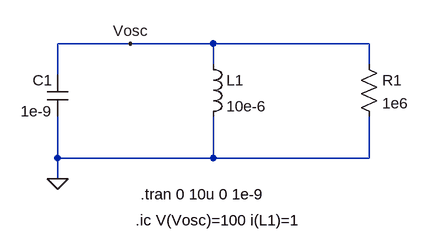
[diagram p0: schematic LCOscill.asc]
LCOscill.asc, the LTspice schematic file:
Version 4
SHEET 1 880 680
WIRE 336 96 224 96
WIRE 464 96 336 96
WIRE 704 96 464 96
WIRE 464 128 464 96
WIRE 704 128 704 96
WIRE 224 144 224 96
WIRE 224 272 224 208
WIRE 464 272 464 208
WIRE 464 272 224 272
WIRE 704 272 704 208
WIRE 704 272 464 272
WIRE 224 304 224 272
FLAG 224 304 0
FLAG 336 96 Vosc
SYMBOL cap 240 208 R180
WINDOW 0 24 56 Left 2
WINDOW 3 24 8 Left 2
SYMATTR InstName C1
SYMATTR Value 1e-9
SYMBOL ind 448 112 R0
SYMATTR InstName L1
SYMATTR Value 10e-6
SYMBOL res 688 112 R0
SYMATTR InstName R1
SYMATTR Value 1e6
TEXT 352 328 Left 2 !.tran 0 10u 0 1e-9
TEXT 344 368 Left 2 !.ic V(Vosc)=100 i(L1)=1

The netlist it stands for:
* LCOscill.asc
C1 0 Vosc 1e-9
L1 Vosc 0 10e-6
R1 Vosc 0 1e6
.tran 0 10u 0 1e-9
.ic V(Vosc)=100 i(L1)=1
.backanno
.end